# Altium schematic sheet Cotton Candy -SCH.SchDoc
size A
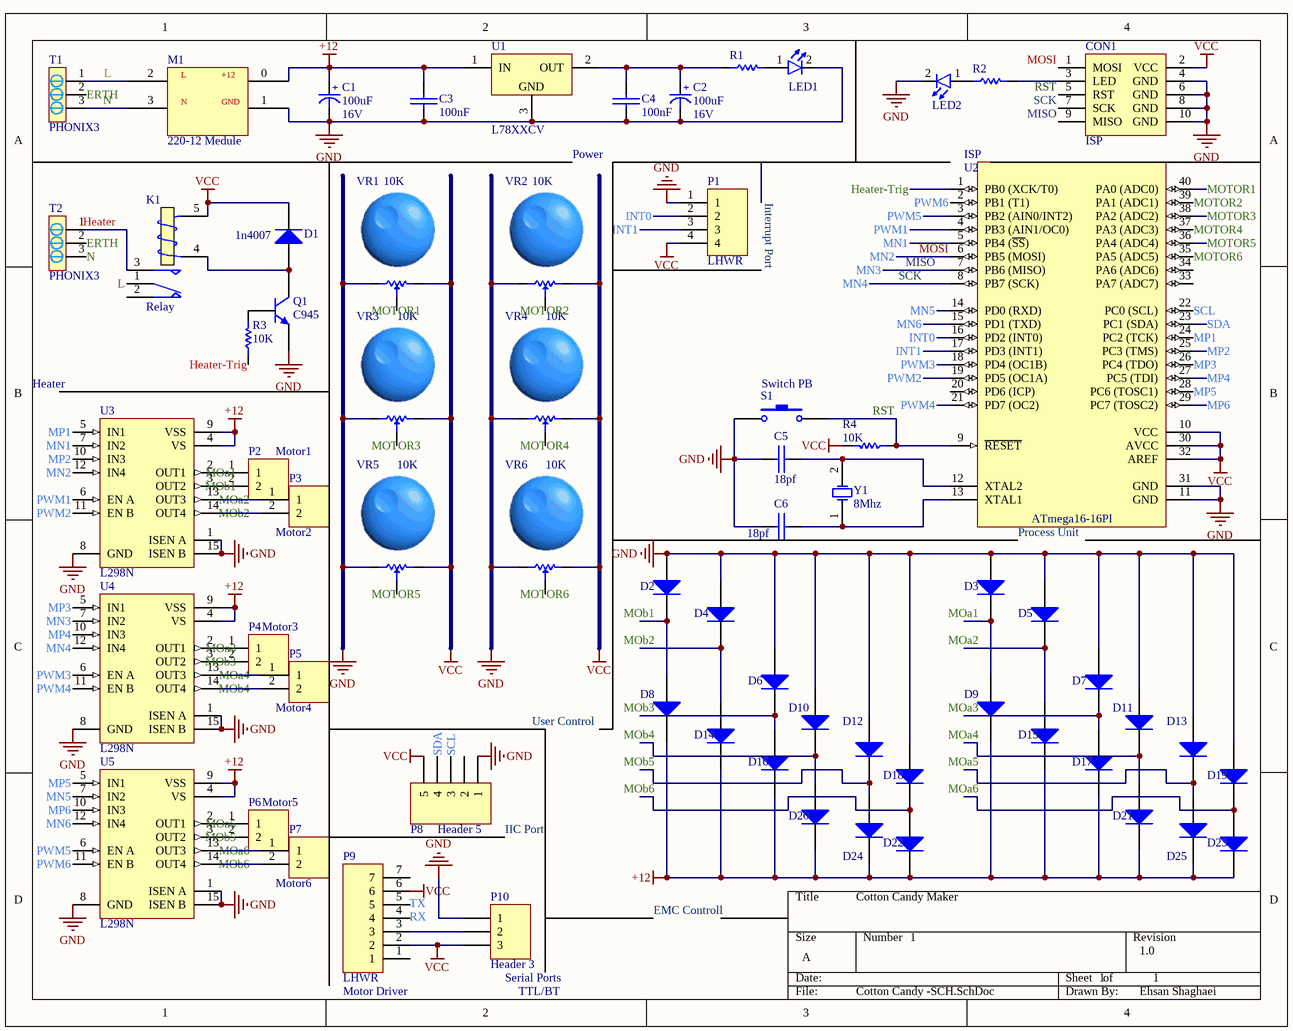
[diagram p0: Cotton Candy -SCH.SchDoc]

## Parts
C1  Voltage: 16V  [cap 03]  (hidden comment: 100uf)
C2  Voltage: 16V  [cap 03]  (hidden comment: 100uf)
C3  100nf  [Cap - 10nF - 630V]
C4  100nf  [Cap - 10nF - 630V]
C5  value 18pf  [Cap - 10nF - 630V]  (hidden comment: 22pf)
C6  value 18pf  [Cap - 10nF - 630V]  (hidden comment: 22pf)
CON1  ISP  [IDC2_5]
D1  1n4007  [BYW98]
D2  (no value)  [My_DO-41]
D3  (no value)  [My_DO-41]
D4  (no value)  [My_DO-41]
D5  (no value)  [My_DO-41]
D6  (no value)  [My_DO-41]
D7  (no value)  [My_DO-41]
D8  (no value)  [My_DO-41]
D9  (no value)  [My_DO-41]
D10  (no value)  [My_DO-41]
D11  (no value)  [My_DO-41]
D12  (no value)  [My_DO-41]
D13  (no value)  [My_DO-41]
D14  (no value)  [My_DO-41]
D15  (no value)  [My_DO-41]
D16  (no value)  [My_DO-41]
D17  (no value)  [My_DO-41]
D18  (no value)  [My_DO-41]
D19  (no value)  [My_DO-41]
D20  (no value)  [My_DO-41]
D21  (no value)  [My_DO-41]
D22  (no value)  [My_DO-41]
D23  (no value)  [My_DO-41]
D24  (no value)  [My_DO-41]
D25  (no value)  [My_DO-41]
K1  Relay  [Relay 15.40x12.10x13.10]
LED1  red  [LED-3mm]  (value not drawn)
LED2  Yellow  [LED-3mm]  (value not drawn)
M1  220-12 Medule  [AC-DC 220-12]
P1  LHWR  [Polarized Header 4]
P2  (no value)  [Polarized Header 2]
P3  (no value)  [Polarized Header 2]
P4  (no value)  [Polarized Header 2]
P5  (no value)  [Polarized Header 2]
P6  (no value)  [Polarized Header 2]
P7  (no value)  [Polarized Header 2]
P8  Header 5  [HDR1X5]
P9  LHWR  [Polarized Header 7]
P10  Header 3  [HDR1X3]
Q1  C945  [C945]
R1  330R  [Res-(1/4)-Stand]  (value not drawn)
R2  330  [Res-(1/4)-Stand]  (value not drawn)
R3  10K  [Res-(1/4)-Stand]
R4  10K  [Res-(1/4)-Stand]
S1  Switch PB  [Switch - Push to On]
T1  PHONIX3  [PHONIX3]
T2  PHONIX3  [PHONIX3]
U1  L78XXCV  [78XXCV - Right]
U2  ATmega16-16PI  [40P6]
U3  L298N  [Multiwatt15V]
U4  L298N  [Multiwatt15V]
U5  L298N  [Multiwatt15V]
VR1  10K  [Setpoint POT]
VR2  10K  [Setpoint POT]
VR3  10K  [Setpoint POT]
VR4  10K  [Setpoint POT]
VR5  10K  [Setpoint POT]
VR6  10K  [Setpoint POT]
Y1  8Mhz  [XTAL Small]

## Nets
+12: C1.1(+) C3.1(+) D8.K D9.K D14.K D15.K D16.K D17.K D20.K D21.K D22.K D23.K D24.K D25.K M1.0 U1.1(IN) U3.4(VS) U3.9(VSS) U4.4(VS) U4.9(VSS) U5.4(VS) U5.9(VSS)
GND: C1.2(-) C2.2(-) C3.2(-) C4.2(-) C5.2(-) C6.2(-) CON1.4(GND) CON1.6(GND) CON1.8(GND) CON1.10(GND) D2.A D3.A D4.A D5.A D6.A D7.A D10.A D11.A D12.A D13.A D18.A D19.A LED1.2(K) LED2.2(K) M1.1 P1.1 P8.1 P10.1 Q1.1(E) S1.1 U1.3(GND) U2.11(GND) U2.31(GND) U3.1(ISEN_A) U3.8(GND) U3.15(ISEN_B) U4.1(ISEN_A) U4.8(GND) U4.15(ISEN_B) U5.1(ISEN_A) U5.8(GND) U5.15(ISEN_B) VR1.1(CCW) VR2.1(CCW) VR3.1(CCW) VR4.1(CCW) VR5.1(CCW) VR6.1(CCW)
VCC: CON1.2(VCC) D1.2(K) K1.5(T2) P1.4 P8.5 P9.2 P9.6 P10.3 R4.2 U2.10(VCC) U2.30(AVCC) U2.32(AREF) VR1.2(CW) VR2.2(CW) VR3.2(CW) VR4.2(CW) VR5.2(CW) VR6.2(CW)
ERTH: T1.2 T2.2
Heater: K1.3(NO) T2.1
Heater-Trig: R3.1 U2.1(PB0_(XCK/T0))
INT0: P1.2 U2.16(PD2_(INT0))
INT1: P1.3 U2.17(PD3_(INT1))
L: K1.1(COM) M1.2 T1.1
MISO: CON1.9(MISO) U2.7(PB6_(MISO)) U4.7(IN2)  [also labelled MN3]
MN1: U2.5(PB4_(~{SS})) U3.7(IN2)
MN2: CON1.1(MOSI) U2.6(PB5_(MOSI)) U3.12(IN4)  [also labelled MOSI]
MN4: CON1.7(SCK) U2.8(PB7_(SCK)) U4.12(IN4)  [also labelled SCK]
MN5: U2.14(PD0_(RXD)) U5.7(IN2)
MN6: U2.15(PD1_(TXD)) U5.12(IN4)
MOa1: D3.K D9.A P2.1 U3.2(OUT1)
MOa2: D5.K D15.A P3.1 U3.13(OUT3)
MOa3: D7.K D17.A P4.1 U4.2(OUT1)
MOa4: D11.K D21.A P5.1 U4.13(OUT3)
MOa5: D13.K D25.A P6.1 U5.2(OUT1)
MOa6: D19.K D23.A P7.1 U5.13(OUT3)
MOb1: D2.K D8.A P2.2 U3.3(OUT2)
MOb2: D4.K D14.A P3.2 U3.14(OUT4)
MOb3: D6.K D16.A P4.2 U4.3(OUT2)
MOb4: D10.K D20.A P5.2 U4.14(OUT4)
MOb5: D12.K D24.A P6.2 U5.3(OUT2)
MOb6: D18.K D22.A P7.2 U5.14(OUT4)
MOTOR1: U2.40(PA0_(ADC0)) VR1.3(SetPoint)
MOTOR2: U2.39(PA1_(ADC1)) VR2.3(SetPoint)
MOTOR3: U2.38(PA2_(ADC2)) VR3.3(SetPoint)
MOTOR4: U2.37(PA3_(ADC3)) VR4.3(SetPoint)
MOTOR5: U2.36(PA4_(ADC4)) VR5.3(SetPoint)
MOTOR6: U2.35(PA5_(ADC5)) VR6.3(SetPoint)
MP1: U2.24(PC2_(TCK)) U3.5(IN1)
MP2: U2.25(PC3_(TMS)) U3.10(IN3)
MP3: U2.26(PC4_(TDO)) U4.5(IN1)
MP4: U2.27(PC5_(TDI)) U4.10(IN3)
MP5: U2.28(PC6_(TOSC1)) U5.5(IN1)
MP6: U2.29(PC7_(TOSC2)) U5.10(IN3)
N: M1.3 T1.3 T2.3
PWM1: U2.4(PB3_(AIN1/OC0)) U3.6(EN_A)
PWM2: U2.19(PD5_(OC1A)) U3.11(EN_B)
PWM3: U2.18(PD4_(OC1B)) U4.6(EN_A)
PWM4: U2.21(PD7_(OC2)) U4.11(EN_B)
PWM5: U2.3(PB2_(AIN0/INT2)) U5.6(EN_A)
PWM6: U2.2(PB1_(T1)) U5.11(EN_B)
RST: CON1.5(RST) R4.1 S1.2 U2.9(~{RESET})
SCL: P8.3 U2.22(PC0_(SCL))
SDA: P8.4 U2.23(PC1_(SDA))
NetC2_1: C2.1(+) C4.1(+) R1.1 U1.2(OUT)
NetC5_1: C5.1(+) U2.12(XTAL2) Y1.2(OSC2)
NetC6_1: C6.1(+) U2.13(XTAL1) Y1.1(OSC1)
NetCON1_3: CON1.3(LED) R2.2
NetD1_1: D1.1(A) K1.4(T1) Q1.2(C)
NetLED1_1: LED1.1(A) R1.2
NetLED2_1: LED2.1(A) R2.1
NetP9_3: P9.3 P10.2
NetQ1_3: Q1.3(B) R3.2

Not connected (* = marked no-connect by the designer): K1 2(NC); P8 2; P9 1 4 5 7; U2 20(PD6_(ICP)) 33(PA7_(ADC7)) 34(PA6_(ADC6))

## Notes on the sheet
- Power
- (near U2) ISP
- Interrupt Port
- (near U3) Heater
- Motor1
- (near P3) Motor2
- (near U2) Process Unit
- (near P4) Motor3
- (near P5) Motor4
- User Control
- (near P6) Motor5
- (near P8) IIC Port
- (near P7) Motor6
- EMC Controll
- Cotton Candy Maker
- (near P10) Serial Ports
- 1
- 1.0
- (near P9) Motor Driver
- (near P10) TTL/BT
- Ehsan Shaghaei
- Labels drawn without touching a wire or pin: RX, TX
- (in symbol 220-12 Medule) L; +12; N; GND

## Library data of the parts
C1 C2 = Cap-Polar: Polar Capacitor; Designer: Saeid Jorablo; Organazation: ControTec; Adding Date: 1387/12/20; Value: 100uF
C3-C6 = Cap-Bipolar: Bipolar Capacitor; Voltage: 100V; Designer: Saeid Jorablo; Organazation: ControTec; Adding Date: 1387/12/20
  C3 C4: Value: 100nF
D1 = BYW98: HIGH EFFICIENCY FAST RECOVERY RECTIFIER DIODES; Designer: Saeid Jorablo; Company: ControTEK; IF(av): 3 A; Vrrm: 200 V; Trr (max): 35 ns; Adding Date: 1387/01/10
D2-D25 = 1N4007: 1 Amp Diode
K1 = Relay: SPDT Relay; Designer: Eng. Saeid Jorablo; Company: E.P.I.L; Design_Date: 2011/10/31
LED1 LED2 = LED: Designer: Saeid Jorablo; Organazation: ControTec; Adding Date: 1387/12/22
P1 = 4pin LHWR: Designer:: Hamed Jafarzadeh - www.R2T.ir
P2-P7 = 2pin LHWR: Designer:: Hamed Jafarzadeh - www.R2T.ir
P8 = Header 5: Header, 5-Pin; LatestRevisionDate: 17-Jul-2002; LatestRevisionNote: Re-released for DXP Platform.; Publisher: Altium Limited
P9 = 7pin LHWR: Designer:: Hamed Jafarzadeh - www.R2T.ir
P10 = Header 3: Header, 3-Pin; LatestRevisionDate: 17-Jul-2002; LatestRevisionNote: Re-released for DXP Platform.; Publisher: Altium Limited
Q1 = C945: NPN Transistor; Designer: Saeid Jorablo; Company: IPA CO; Last Update Time: 2008/08/04; Value: C945
R1 R3 R4 = Resistor
  R3 R4: Value: 10K
R2 = Resistor: 330R
S1 = Switch PB: Push Button Switch
U1 = L78XXCV: Fixed Voltage Regulator; Designer: Saeid Jorablo; Company: ControTec; Adding Date: 1387/01/06; Voltage: *
U2 = ATmega16-16PI: 8-Bit AVR Microcontroller with 16K Bytes of In-System Programmable Flash Memory; Published: 17-Sep-2003; LatestRevisionDate: 04-Mar-2005; LatestRevisionNote: Stylized 3D Model Added.; DatasheetVersion: 2466E-AVR-10/02; PackageVersion: Dec-1999; PackageReference: 40P6; Publisher: Altium Limited; PackageDescription: DIP; 40 Leads; Row Spacing 15.24 mm; Pitch 2.54 mm; ComponentLink1Description: Manufacturer Link; ComponentLink1URL: http://www.atmel.com; ComponentLink2Description: Datasheet; ComponentLink2URL: http://www.atmel.com/dyn/resources/prod_documents/doc2466.pdf
U3-U5 = L298N: Dual Full Bridge Driver; Revision 1: 24-Aug-2001: Footprint Added.; Revision 2: 17-Jul-2002: Re-released for DXP Platform.; Package Information: Latest Revision: Apr-1998; Published: 8-Jun-2000; Datasheet: Latest Revision: Jul-1999; Package Reference: Multiwatt15H; Publisher: Altium Limited
VR1-VR6 = Setpoint V: Variable Resistor; Designer: Saeid Jorablo; Company: *; Value: 10K
Y1 = XTAL: XTAL Crystal; Company: E.P.I.L; Design Date: 11/04/2011; Value: 8Mhz